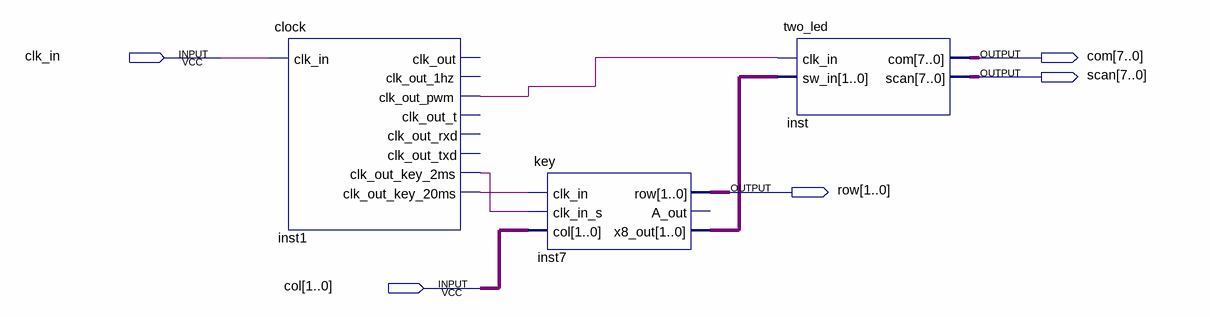
[diagram p0: schematic sheet]
// Quartus schematic two_led_bdf.bdf as structural Verilog: 3 symbols, 5 pins
module two_led_bdf (
  input  clk_in,
  input  [1:0] col,
  output [7:0] com,
  output [7:0] scan,
  output [1:0] row
);

  wire inst1_clk_out_key_2ms, inst1_clk_out_key_20ms, inst1_clk_out_pwm;
  wire [1:0] inst7_x8_out;

  clock inst1 (
    .clk_in(clk_in), .clk_out_pwm(inst1_clk_out_pwm), .clk_out_key_2ms(inst1_clk_out_key_2ms),
    .clk_out_key_20ms(inst1_clk_out_key_20ms));  // open: clk_out, clk_out_1hz, clk_out_t, clk_out_rxd, clk_out_txd
  key inst7 (
    .clk_in(inst1_clk_out_key_20ms), .clk_in_s(inst1_clk_out_key_2ms), .col(col), .row(row),
    .x8_out(inst7_x8_out));  // open: A_out
  two_led inst (.clk_in(inst1_clk_out_pwm), .sw_in(inst7_x8_out), .com(com), .scan(scan));
endmodule
